# Altium schematic sheet Transmit.SchDoc
size 558 x 431 mm; SheetNumber: 5; SheetTotal: 6
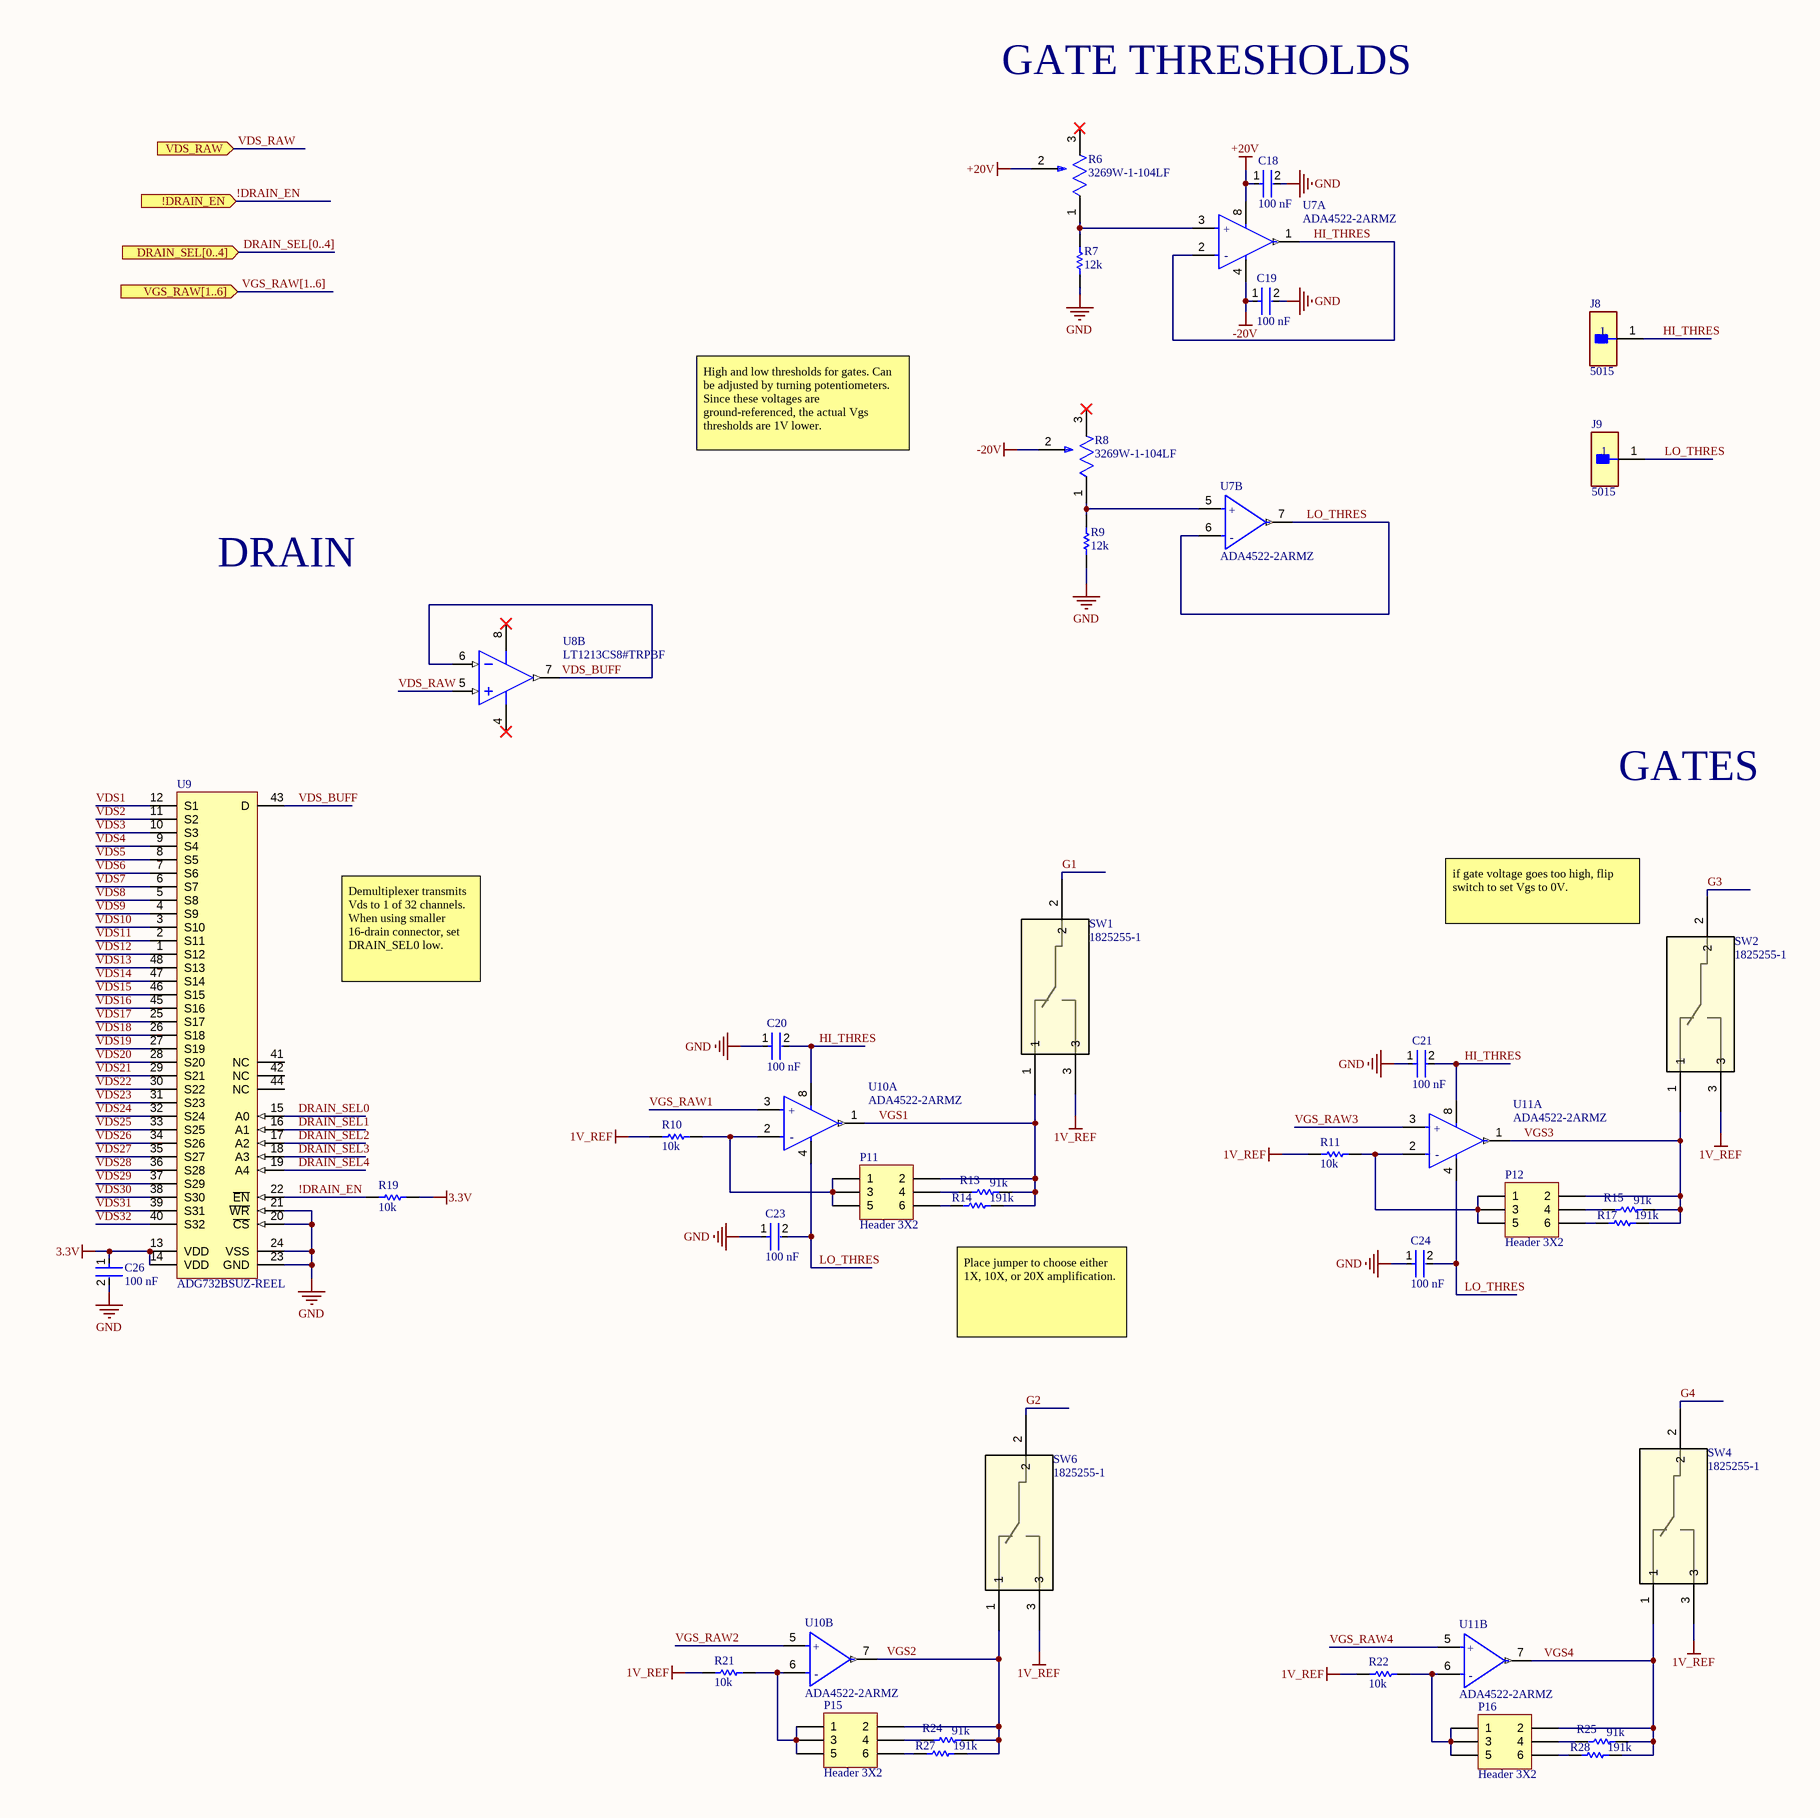
[diagram p0: Transmit.SchDoc, left]
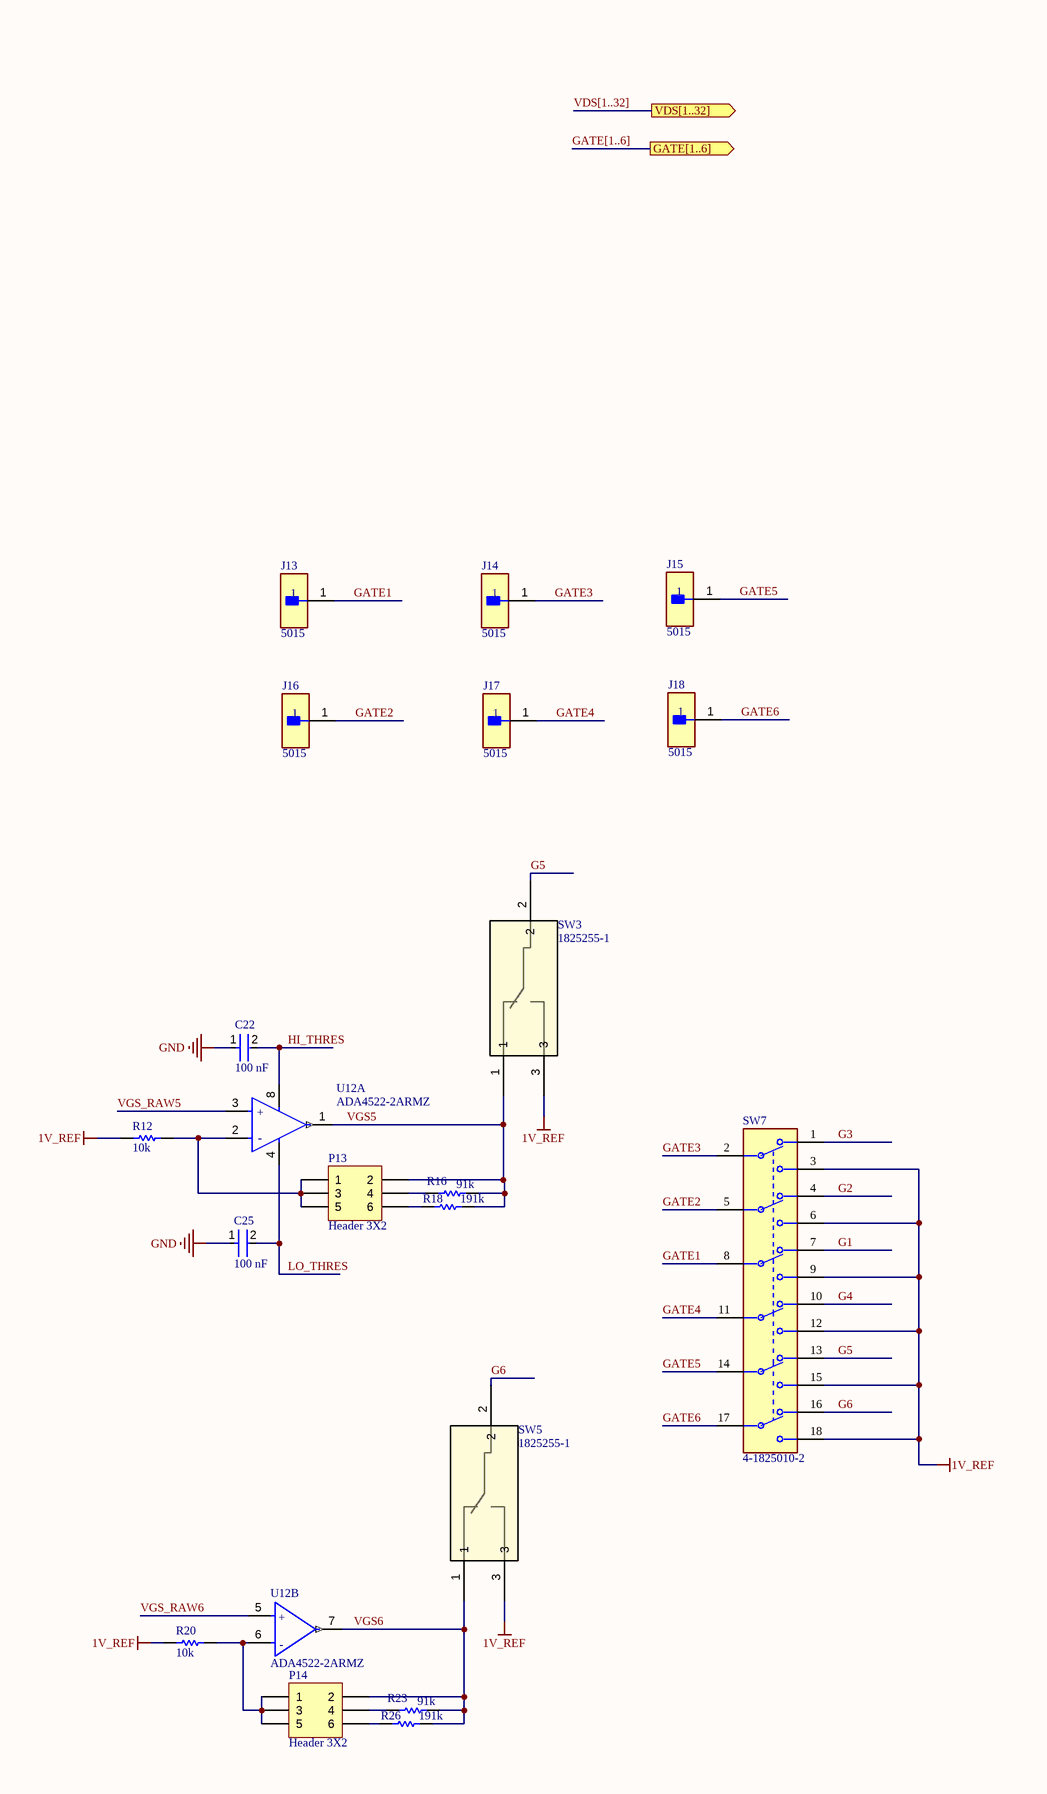
[diagram p1: Transmit.SchDoc, right]

## Parts
C18  100 nF  [FP-C0805C-DN-MFG]
C19  100 nF  [FP-C0805C-DN-MFG]
C20  100 nF  [FP-C0805C-DN-MFG]
C21  100 nF  [FP-C0805C-DN-MFG]
C22  100 nF  [FP-C0805C-DN-MFG]
C23  100 nF  [FP-C0805C-DN-MFG]
C24  100 nF  [FP-C0805C-DN-MFG]
C25  100 nF  [FP-C0805C-DN-MFG]
C26  100 nF  [FP-C0805C-DN-MFG]
J8  5015  [FP-5015-MFG]
J9  5015  [FP-5015-MFG]
J13  5015  [FP-5015-MFG]
J14  5015  [FP-5015-MFG]
J15  5015  [FP-5015-MFG]
J16  5015  [FP-5015-MFG]
J17  5015  [FP-5015-MFG]
J18  5015  [FP-5015-MFG]
P11  Header 3X2  [HDR2X3]
P12  Header 3X2  [HDR2X3]
P13  Header 3X2  [HDR2X3]
P14  Header 3X2  [HDR2X3]
P15  Header 3X2  [HDR2X3]
P16  Header 3X2  [HDR2X3]
R6  3269W-1-104LF  [FP-3269W-MFG]
R7  12k  [RESC2013X60X40ML20T25]
R8  3269W-1-104LF  [FP-3269W-MFG]
R9  12k  [RESC2013X60X40ML20T25]
R10  10k  [RESC2013X60X35NL10T20]
R11  10k  [RESC2013X60X35NL10T20]
R12  10k  [RESC2013X60X35NL10T20]
R13  91k  [RESC2013X60X40LL20T25]
R14  191k  [RESC2013X70X40ML20T20]
R15  91k  [RESC2013X60X40LL20T25]
R16  91k  [RESC2013X60X40LL20T25]
R17  191k  [RESC2013X70X40ML20T20]
R18  191k  [RESC2013X70X40ML20T20]
R19  10k  [RESC2013X60X35NL10T20]
R20  10k  [RESC2013X60X35NL10T20]
R21  10k  [RESC2013X60X35NL10T20]
R22  10k  [RESC2013X60X35NL10T20]
R23  91k  [RESC2013X60X40LL20T25]
R24  91k  [RESC2013X60X40LL20T25]
R25  91k  [RESC2013X60X40LL20T25]
R26  191k  [RESC2013X70X40ML20T20]
R27  191k  [RESC2013X70X40ML20T20]
R28  191k  [RESC2013X70X40ML20T20]
SW1  1825255-1  [SW3_1825255-1_TEC]
SW2  1825255-1  [SW3_1825255-1_TEC]
SW3  1825255-1  [SW3_1825255-1_TEC]
SW4  1825255-1  [SW3_1825255-1_TEC]
SW5  1825255-1  [SW3_1825255-1_TEC]
SW6  1825255-1  [SW3_1825255-1_TEC]
SW7  4-1825010-2  [FP-4-1825010-2-MFG]
U7  ADA4522-2ARMZ  [FP-RM-8-IPC_C]  (parts A,B of 2)
U8  LT1213CS8#TRPBF  [LT-S8-8_N]  (part B of 2)
U9  ADG732BSUZ-REEL  [ADI-SU-48_N]
U10  ADA4522-2ARMZ  [FP-RM-8-IPC_C]  (parts A,B of 2)
U11  ADA4522-2ARMZ  [FP-RM-8-IPC_C]  (parts A,B of 2)
U12  ADA4522-2ARMZ  [FP-RM-8-IPC_C]  (parts A,B of 2)

## Ports
!DRAIN_EN (in), DRAIN_SEL[0..4] (in), GATE[1..6] (out), VDS[1..32] (out), VDS_RAW (in), VGS_RAW[1..6] (in)

## Nets
1V_REF: R10.2 R11.2 R12.2 R20.2 R21.2 R22.2 SW1.3 SW2.3 SW3.3 SW4.3 SW5.3 SW6.3 SW7.3 SW7.6 SW7.9 SW7.12 SW7.15 SW7.18
3.3V: C26.1 R19.1 U9.13(VDD) U9.14(VDD)
+20V: C18.1 R6.2(WIPER) U7.8(V+)
-20V: C19.1 R8.2(WIPER) U7.4(V-)
GND: C18.2 C19.2 C20.1 C21.1 C22.1 C23.1 C24.1 C25.1 C26.2 R7.1 R9.1 U9.20(~{CS}) U9.21(~{WR}) U9.23(GND) U9.24(VSS)
!DRAIN_EN: R19.2 U9.22(~{EN}) ; port !DRAIN_EN
DRAIN_SEL0: U9.15(A0)
DRAIN_SEL1: U9.16(A1)
DRAIN_SEL2: U9.17(A2)
DRAIN_SEL3: U9.18(A3)
DRAIN_SEL4: U9.19(A4)
G1: SW1.2 SW7.7
G2: SW6.2 SW7.4
G3: SW2.2 SW7.1
G4: SW4.2 SW7.10
G5: SW3.2 SW7.13
G6: SW5.2 SW7.16
GATE1: J13.1 SW7.8
GATE2: J16.1 SW7.5
GATE3: J14.1 SW7.2
GATE4: J17.1 SW7.11
GATE5: J15.1 SW7.14
GATE6: J18.1 SW7.17
HI_THRES: C20.2 C21.2 C22.2 J8.1 U7.1(OUT_A) U7.2(-IN_A) U10.8(V+) U11.8(V+) U12.8(V+)
LO_THRES: C23.2 C24.2 C25.2 J9.1 U7.6(-IN_B) U7.7(OUT_B) U10.4(V-) U11.4(V-) U12.4(V-)
VDS1: U9.12(S1)
VDS2: U9.11(S2)
VDS3: U9.10(S3)
VDS4: U9.9(S4)
VDS5: U9.8(S5)
VDS6: U9.7(S6)
VDS7: U9.6(S7)
VDS8: U9.5(S8)
VDS9: U9.4(S9)
VDS10: U9.3(S10)
VDS11: U9.2(S11)
VDS12: U9.1(S12)
VDS13: U9.48(S13)
VDS14: U9.47(S14)
VDS15: U9.46(S15)
VDS16: U9.45(S16)
VDS17: U9.25(S17)
VDS18: U9.26(S18)
VDS19: U9.27(S19)
VDS20: U9.28(S20)
VDS21: U9.29(S21)
VDS22: U9.30(S22)
VDS23: U9.31(S23)
VDS24: U9.32(S24)
VDS25: U9.33(S25)
VDS26: U9.34(S26)
VDS27: U9.35(S27)
VDS28: U9.36(S28)
VDS29: U9.37(S29)
VDS30: U9.38(S30)
VDS31: U9.39(S31)
VDS32: U9.40(S32)
VDS_BUFF: U8.6(-IN_B) U8.7(OUT_B) U9.43(D)
VDS_RAW: U8.5(+IN_B) ; port VDS_RAW
VGS1: P11.2 R13.2 R14.2 SW1.1 U10.1(OUT_A)
VGS2: P15.2 R24.2 R27.2 SW6.1 U10.7(OUT_B)
VGS3: P12.2 R15.2 R17.2 SW2.1 U11.1(OUT_A)
VGS4: P16.2 R25.2 R28.2 SW4.1 U11.7(OUT_B)
VGS5: P13.2 R16.2 R18.2 SW3.1 U12.1(OUT_A)
VGS6: P14.2 R23.2 R26.2 SW5.1 U12.7(OUT_B)
VGS_RAW1: U10.3(+IN_A)
VGS_RAW2: U10.5(+IN_B)
VGS_RAW3: U11.3(+IN_A)
VGS_RAW4: U11.5(+IN_B)
VGS_RAW5: U12.3(+IN_A)
VGS_RAW6: U12.5(+IN_B)
NetP11_1: P11.1 P11.3 P11.5 R10.1 U10.2(-IN_A)
NetP11_4: P11.4 R13.1
NetP11_6: P11.6 R14.1
NetP12_1: P12.1 P12.3 P12.5 R11.1 U11.2(-IN_A)
NetP12_4: P12.4 R15.1
NetP12_6: P12.6 R17.1
NetP13_1: P13.1 P13.3 P13.5 R12.1 U12.2(-IN_A)
NetP13_4: P13.4 R16.1
NetP13_6: P13.6 R18.1
NetP14_1: P14.1 P14.3 P14.5 R20.1 U12.6(-IN_B)
NetP14_4: P14.4 R23.1
NetP14_6: P14.6 R26.1
NetP15_1: P15.1 P15.3 P15.5 R21.1 U10.6(-IN_B)
NetP15_4: P15.4 R24.1
NetP15_6: P15.6 R27.1
NetP16_1: P16.1 P16.3 P16.5 R22.1 U11.6(-IN_B)
NetP16_4: P16.4 R25.1
NetP16_6: P16.6 R28.1
NetR6_1: R6.1(CCW) R7.2 U7.3(+IN_A)
NetR8_1: R8.1(CCW) R9.2 U7.5(+IN_B)

Not connected (* = marked no-connect by the designer): R6 3(CW)*; R8 3(CW)*; U8 4(V-)* 8(V+)*; U9 41(NC) 42(NC) 44(NC)

## Buses and harness runs
bus DRAIN_SEL[0..4] = port DRAIN_SEL[0..4]
bus GATE[1..6] = port GATE[1..6]
bus VDS[1..32] = port VDS[1..32]
bus VGS_RAW[1..6] = port VGS_RAW[1..6]

## Notes on the sheet
- GATE THRESHOLDS
- High and low thresholds for gates. Can be adjusted by turning potentiometers. Since these voltages are ground-referenced, the actual Vgs thresholds are 1V lower.
- DRAIN
- GATES
- (near SW2) if gate voltage goes too high, flip switch to set Vgs to 0V.
- Demultiplexer transmits Vds to 1 of 32 channels. When using smaller 16-drain connector, set DRAIN_SEL0 low.
- Place jumper to choose either 1X, 10X, or 20X amplification.
- DWG. NO.
- REV.
- SHT.
- REVISION
- DESCRIPTION
- DATE
- APPROVED
- THIS DOCUMENT AND THE DATA DISCLOSED HEREIN OR HEREWITH IS THE PROPERTY OF ALTIUM LIMITED AND MAY BE FREELY DISTRIBUTED IN WHOLE. NO RIGHTS ARE RESERVED OR EXPRESS OR IMPLIED WARANTEE GIVEN.
- ENG:
- DSN:
- APPROVALS
- PROJECT
- DOCUMENT REVISION:
- DESIGN ITEM:
- CHK:
- BOM:
- REFERENCE DOCUMENTS
- PROJECT REVISION:
- TITLE
- FAB DWG:
- PCB DWG:
- ASSY DWG:
- SCALE:
- SIZE
- C
- CAGE CODE
- FILE NAME
- DWG NO.
- SHEET
- OF
- REV
- (in symbol CMP-09116-000003-2, part A) +; -
- (in symbol CMP-09116-000003-2, part B) +; -

## Library data of the parts
C18-C26 = CMP-2007-00279-2: CAP CER 0.1UF 50V X7R 0805; Manufacturer Part Number: C0805C104K5RACTU; Manufacturer: KEMET; Value: 0.10 μF; Tolerance: 0.1; Temperature Coefficient: 30ppm/°C; Material: Ceramic; Device Class L2: Capacitors; Temperature Range Low: -55°C; Voltage Rating: 50 V; Digikey Description: CAP CER 0.1UF 50V X7R 0805; Category: Cap; ComponentLink2Description: Datasheet; Octopart: https://octopart.com/c0805c104k5ractu-kemet-143926; RoHS: TRUE; ComponentLink2URL: https://content.kemet.com/datasheets/KEM_C1003_C0G_SMD.pdf; Temperature Characteristic: X7R; Temperature: -55°C to +125°C; Height: 0.88mm; Temperature Range High: +125°C; Device Class L1: Passive Components; Automotive: No; Lead Free: Yes; Ipc Land Pattern Name: CAPC200125X78; Device Class L3: Ceramic Capacitors; Mouser Description: Cap Ceramic 0.1uF 50V X7R 10% SMD 2.0 x 1.2 mm 125 C Paper T/R; Capacitance: 0.10 μF; Package: C0805C-DN
J8 J9 J13-J18 = CMP-2000-05183-2: PC TEST POINT MINIATURE; Manufacturer: keystone; Number Of Contacts: 1; Conn Orientation: Straight; Category: Conn; Manufacturer Part Number: 5015; Digikey Description: PC TEST POINT MINIATURE; Automotive: No; Lead Free: Yes; Octopart: https://octopart.com/5015-keystone-3822; ComponentLink2URL: http://www.keyelco.com/product-pdf.cfm?p=1353; Package: 5015; RoHS: TRUE; Device Class L3: unset; Device Class L2: unset; Contact Material: Silver; Device Class L1: Connectors; Height: 1.65mm; ComponentLink2Description: Datasheet
P11-P16 = Header 3X2: Header, 3-Pin, Dual row; LatestRevisionDate: 17-Jul-2002; LatestRevisionNote: Re-released for DXP Platform.; Publisher: Altium Limited
R6 R8 = CMP-07234-000021-1: TRIMMER 100K OHM 0.25W SMD; Manufacturer: Bourns; Temperature Coefficient: 100ppm/°C; Tolerance: 10%; Resistance: 100kΩ; Value: 100kΩ; Composition: Cermet; Height: 8.96mm; ComponentLink2URL: https://www.bourns.com/docs/Product-Datasheets/3269.pdf; Mouser Description: Res Cermet Trimmer 100K Ohm 10% 1/4W 12(Elec)Turn 1.78mm (6.35 X 6.36 X 8.46mm) Gull Wing SMD Tube; ComponentLink2Description: Datasheet; Temperature Range High: +150°C; Temperature: -65°C to +150°C; Series: 3269; Device Class L1: Passive Components; RoHS: TRUE; Octopart: https://octopart.com/3269w-1-104lf-bourns-114162; Temperature Range Low: -65°C; Device Class L2: Resistors; Digikey Description: TRIMMER 100K OHM 0.25W SMD; Manufacturer Part Number: 3269W-1-104LF; Power Rating: 0.25W; Device Class L3: Variable Resistors and Potentiometers; Lead Free: Yes; Package: 3269W; Category: Res; Automotive: No
R7 R9 = CMP-2001-00590-1: Part Number: ERA6AEB123V; Manufacturer: Panasonic
R10-R12 R19-R22 = CMP-1659-00013-4: Chip Resistor, 10 KOhm, +/- 1%, 0.125 W, -55 to 155 degC, 0805 (2012 Metric), RoHS, Tape and Reel; Manufacturer: Yageo; Voltage Rating: 150 V; Mount: Surface Mount; ComponentLink1Description: Manufacturer URL; ComponentLink2URL: http://www.yageo.com/documents/recent/PYu-RC_Group_51_RoHS_L_04.pdf; Pins: 2; Length: 2 mm; Min Operating Temperature: -55 degC; Height: 0.5 mm; Mounting Technology: Surface Mount; RoHSCompliant: true; REACH SVHC: No SVHC; ComponentLink1URL: http://www.yageo.com/; Max Operating Temperature: 155 degC; PackageReference: 0805; DatasheetVersion: Rev. 4, 02/2016; Package Quantity: 5000; Packaging: Tape and Reel; ComponentLink2Description: Datasheet; PackageDescription: 2-Pin Surface Mounted Device, Body 2 x 1.25 mm
R13 R15 R16 R23-R25 = CMP-2001-00677-1: Part Number: ERA6AEB913V; Manufacturer: Panasonic
R14 R17 R18 R26-R28 = CMP-2001-00021-1: Manufacturer: Panasonic; Part Number: ERJ-6ENF1913V
SW1-SW6 = 1825255-1: No Description Available; Mfr_Name: TE Connectivity; Copyright: Copyright (C) 2022 Ultra Librarian. All rights reserved.; Manufacturer_Part_Number: 1825255-1; RefDes: RefDes; Type: DEV
SW7 = CMP-03405-000018-1: SWITCH SLIDE 6PDT 300MA 115V; PCB Mount Retention: Without; Switching Capacity: 400mW; Insulation Resistance: 1GR; Actuator Type: Standard; Switch Function: On-On; Number of Positions: 6; Actuator Length: 2.79mm; Actuator Material: Nylon; Contact Current Rating: 300mA; Packaging: Rail/Tube; Max Voltage Rating (AC): 115V; Min Operating Temperature: -40°C; Contact Plating: Silver; Max Current Rating: 300mA; Orientation: Vertical; Depth: 9.4mm; Max Operating Temperature: 80°C; Termination: Gull Wing; Radiation Hardening: No; Flammability Rating: UL94 V-0; Type: Switch; Mount: Surface Mount; Case/Package: SMD/SMT; Series: ASE; Throw Configuration: 6PDT; Length: 1inch; Housing Material: Polychlorinated; Contact Material: Copper Alloy; Width: 7.37mm; RoHS Compliant: Yes; Package Quantity: 252
U7 U10-U12 = CMP-09116-000003-2: IC OPAMP ZERO-DRIFT 2 CIRC 8MSOP; Max Dual Supply Voltage: 27.5V; Power Supply Rejection Ratio (PSRR): 150dB; Operating Supply Current: 830uA; Max Supply Voltage: 55V; Min Dual Supply Voltage: 2.25V; Input Bias Current: 50pA; Gain Bandwidth Product: 2.7MHz; Voltage Gain: 137dB; Common Mode Rejection Ratio: 140dB; Slew Rate: 1.7V/µs; Input Offset Voltage (Vos): 1.5uV; Output Current per Channel: 32mA; Min Supply Voltage: 4.5V; Packaging: Rail/Tube; Max Operating Temperature: 125°C; Min Operating Temperature: -40°C; Mount: Surface Mount; Number of Pins: 8; Case/Package: MSOP; Lead Free: Contains Lead
U8 = CMP-0359-03127-2: Dual Channel, Precision, Fast Operational Amplifier, 28 MHz Typical GBW, 8.5 V/us Typical SR, 2.5 to 36 V, 8-Pin SOIC (S8-8), Commercial, Pb-Free, Reel; Linear Technology Part Number: LT1213; Manufacturer: Linear Technology; Vos (mV) Typical: 0.075; Vs Max (V): 36; SR (V/us) Typical: 8.5; GBW (MHz) Typical: 28; Vs Min (V): 2.5; Is (mA) Typical: 2.7; Channels (#): 2; ComponentLink2Description: Datasheet; ComponentLink1Description: Manufacturer URL; RoHS: Pb-Free; DatasheetVersion: Rev. A; RevisionNote: URLs updated; Packing: Reel; ComponentLink3Description: Package Specification; ComponentLink2URL: http://cds.linear.com/docs/en/datasheet/12134fa.pdf; ComponentLink3URL: http://cds.linear.com/docs/en/packaging/05081610_G_SO8.pdf; Mounting Technology: Surface Mount; Type: VFB; PartNumber: LT1213CS8#TRPBF; PackageDescription: 8-Pin Plastic Small Outline, Body 4.9 x 3.9 mm, Pitch 1.27 mm; ComponentLink1URL: http://www.linear.com/; PackageVersion: Rev G; PackageReference: LT-S8-8
U9 = CMP-0798-00236-1: 1.8 to 5.5 V / +/-2.5 V, 4 Ohm, 32-Channel Analog Multiplexer, -40 to 85 degC, 48-pin QFP (SU-48), Reel; Manufacturer: Analog Devices; Ron (ohms): 4; Max Analog Signal Range: Vss to Vdd; Bandwidth (Hz): 18M; Supply V Guar Performance: Dual_(+/-2.5V), Single_(+3V), Single_(+5V); t transition (s): 23n; PackageReference: SU-48; ComponentLink3URL: http://www.analog.com/static/imported-files/packages/470644706845302410119987SU48_7x7.pdf; PartNumber: ADG732BSUZ-REEL; ComponentLink1URL: http://www.analog.com/en/index.html; Mounting Technology: Surface Mount; ComponentLink2Description: Datasheet; Packing: Reel; ComponentLink1Description: Manufacturer URL; DatasheetVersion: Rev. 0; ComponentLink2URL: http://www.analog.com/static/imported-files/data_sheets/ADG726_732.pdf; PackageDescription: 48-Pin Thin Plastic Quad Flat Package, Body 7 x 7 mm, Pitch 0.5 mm; Code_JEDEC: MS-026ABC; ComponentLink3Description: Package Specification